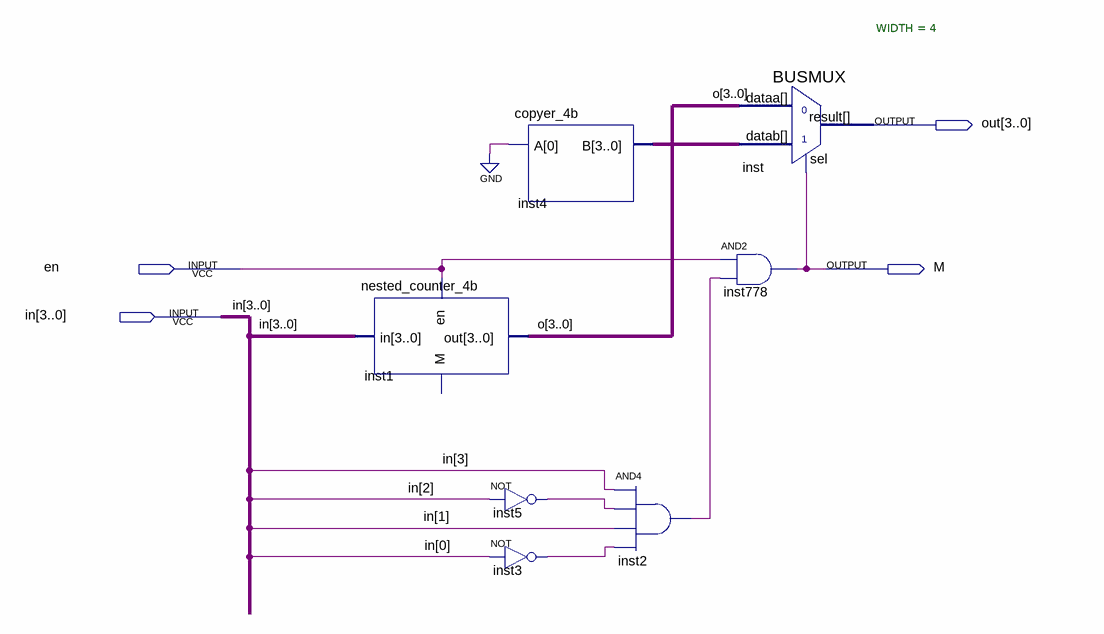
[diagram p0: schematic sheet]
// Quartus schematic nested_counter_15d.bdf as structural Verilog: 7 symbols, 4 pins
module nested_counter_15d (
  input  en,
  input  [3:0] in,
  output [3:0] out,
  output M
);

  wire inst2_out, inst3_out, inst5_out;
  wire [3:0] inst4_b, o;

  nested_counter_4b inst1 (.en(en), .in(in), .out(o));  // open: M
  not inst5 (inst5_out, in[2]);
  not inst3 (inst3_out, in[0]);
  copyer_4b inst4 (.A(1'b0), .B(inst4_b));
  and inst2 (inst2_out, in[3], inst5_out, in[1], inst3_out);
  and inst778 (M, en, inst2_out);
  BUSMUX #(.WIDTH(4)) inst (.datab(inst4_b), .sel(M), .dataa(o), .result(out));
endmodule
